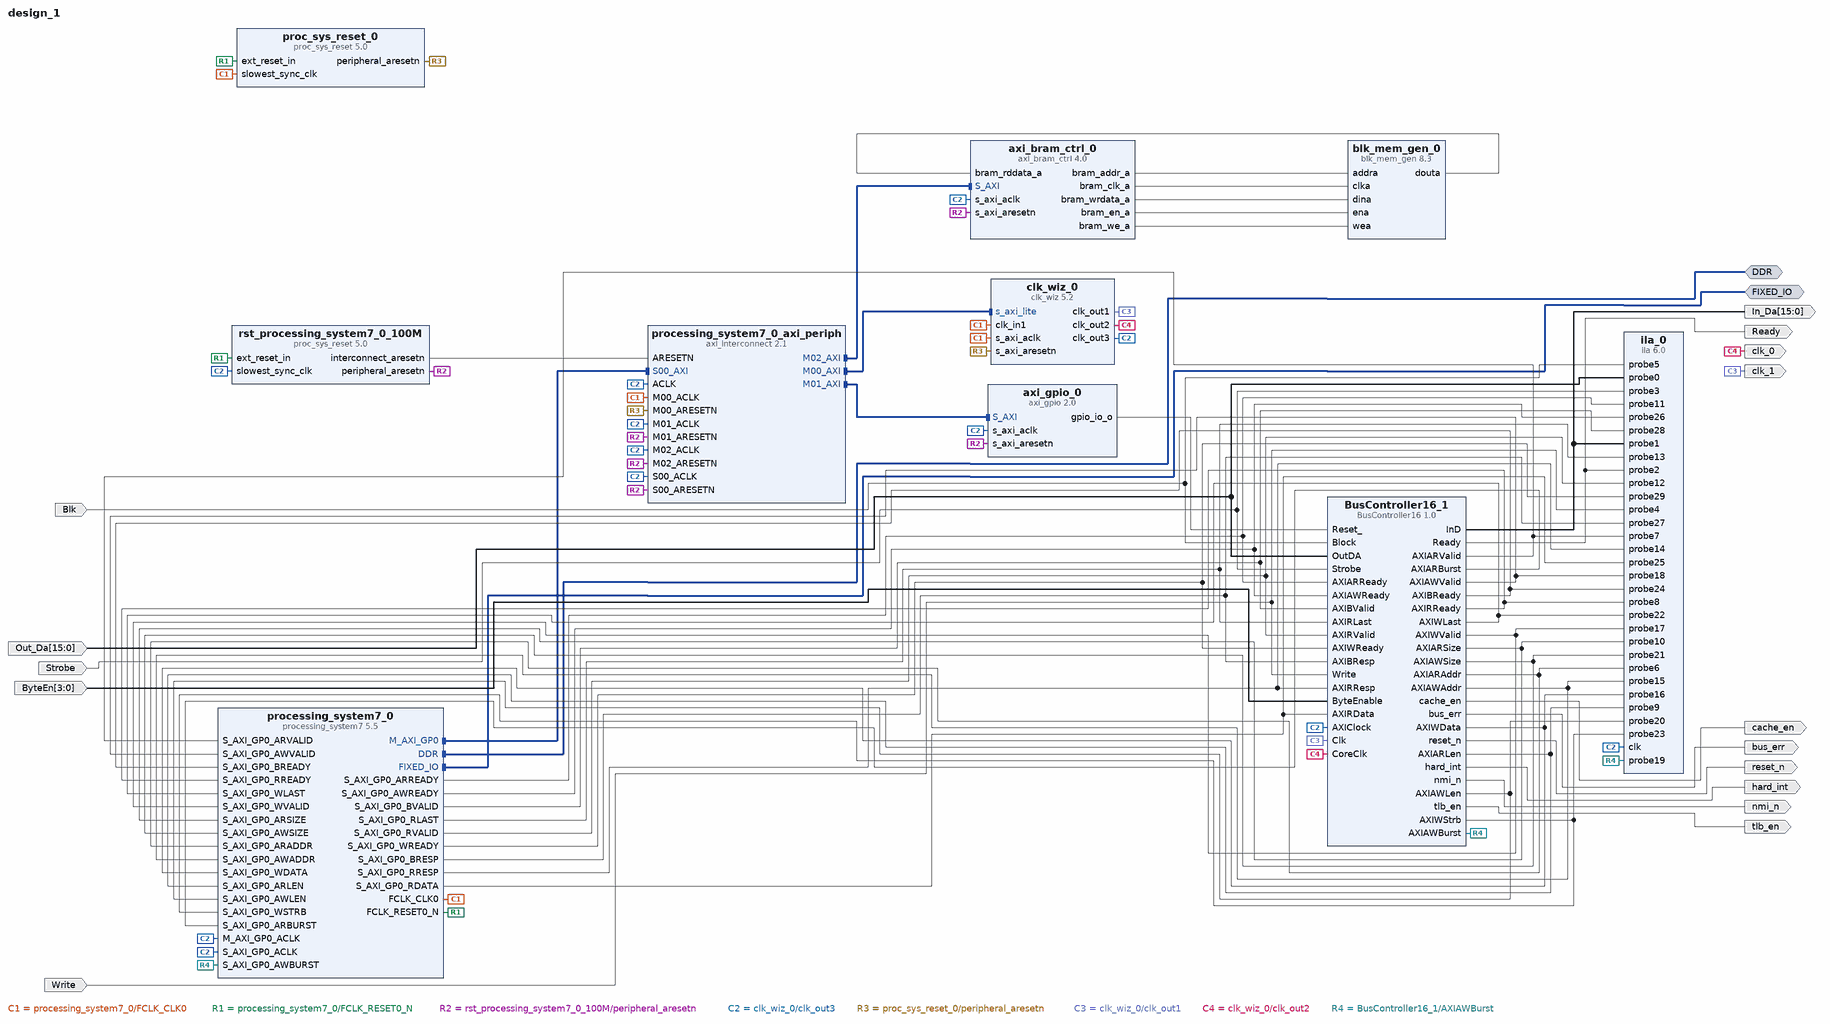
[diagram p0: block diagram of the top level]
# Vivado block design design_1, Vivado 2015.4
create_bd_design design_1

create_bd_intf_port -mode Master -vlnv xilinx.com:interface:ddrx_rtl:1.0 DDR
create_bd_intf_port -mode Master -vlnv xilinx.com:display_processing_system7:fixedio_rtl:1.0 FIXED_IO
create_bd_port -dir I Strobe
create_bd_port -dir I Write
create_bd_port -dir I Blk
create_bd_port -dir I -from 15 -to 0 Out_Da
create_bd_port -dir I -from 3 -to 0 ByteEn
create_bd_port -dir O clk_0
create_bd_port -dir O -type clk clk_1
create_bd_port -dir O reset_n
create_bd_port -dir O nmi_n
create_bd_port -dir O tlb_en
create_bd_port -dir O bus_err
create_bd_port -dir O hard_int
create_bd_port -dir O cache_en
create_bd_port -dir O Ready
create_bd_port -dir O -from 15 -to 0 In_Da

create_bd_cell -type ip -vlnv xilinx.com:ip:processing_system7:5.5 processing_system7_0
set_property -dict [list \
  CONFIG.PCW_FCLK_CLK0_BUF true \
  CONFIG.PCW_APU_PERIPHERAL_FREQMHZ 667 \
  CONFIG.PCW_QSPI_PERIPHERAL_FREQMHZ 200.000000 \
  CONFIG.PCW_SDIO_PERIPHERAL_FREQMHZ 50 \
  CONFIG.PCW_UART_PERIPHERAL_FREQMHZ 50 \
  CONFIG.PCW_FPGA0_PERIPHERAL_FREQMHZ 100 \
  CONFIG.PCW_FPGA1_PERIPHERAL_FREQMHZ 100 \
  CONFIG.PCW_FPGA2_PERIPHERAL_FREQMHZ 33.333333 \
  CONFIG.PCW_USE_S_AXI_GP0 1 \
  CONFIG.PCW_PRESET_BANK1_VOLTAGE {LVCMOS 1.8V} \
  CONFIG.PCW_UIPARAM_DDR_PARTNO {MT41K256M16 RE-125} \
  CONFIG.PCW_QSPI_PERIPHERAL_ENABLE 1 \
  CONFIG.PCW_QSPI_GRP_SINGLE_SS_ENABLE 1 \
  CONFIG.PCW_QSPI_GRP_SINGLE_SS_IO {MIO 1 .. 6} \
  CONFIG.PCW_QSPI_GRP_FBCLK_ENABLE 1 \
  CONFIG.PCW_QSPI_GRP_FBCLK_IO {MIO 8} \
  CONFIG.PCW_ENET0_PERIPHERAL_ENABLE 1 \
  CONFIG.PCW_ENET0_ENET0_IO {MIO 16 .. 27} \
  CONFIG.PCW_ENET0_GRP_MDIO_ENABLE 1 \
  CONFIG.PCW_ENET0_GRP_MDIO_IO {MIO 52 .. 53} \
  CONFIG.PCW_ENET0_RESET_ENABLE 0 \
  CONFIG.PCW_SD0_PERIPHERAL_ENABLE 1 \
  CONFIG.PCW_SD0_SD0_IO {MIO 40 .. 45} \
  CONFIG.PCW_SD0_GRP_CD_ENABLE 1 \
  CONFIG.PCW_SD0_GRP_CD_IO {MIO 46} \
  CONFIG.PCW_SD0_GRP_WP_ENABLE 1 \
  CONFIG.PCW_SD0_GRP_WP_IO {MIO 50} \
  CONFIG.PCW_UART1_PERIPHERAL_ENABLE 1 \
  CONFIG.PCW_UART1_UART1_IO {MIO 48 .. 49} \
  CONFIG.PCW_TTC0_PERIPHERAL_ENABLE 1 \
  CONFIG.PCW_TTC0_TTC0_IO EMIO \
  CONFIG.PCW_USB0_PERIPHERAL_ENABLE 1 \
  CONFIG.PCW_USB0_USB0_IO {MIO 28 .. 39} \
  CONFIG.PCW_USB0_RESET_ENABLE 1 \
  CONFIG.PCW_USB0_RESET_IO {MIO 7} \
  CONFIG.PCW_I2C0_PERIPHERAL_ENABLE 1 \
  CONFIG.PCW_I2C0_I2C0_IO {MIO 14 .. 15} \
  CONFIG.PCW_I2C_RESET_ENABLE 0 \
  CONFIG.PCW_GPIO_PERIPHERAL_ENABLE 1 \
  CONFIG.PCW_GPIO_MIO_GPIO_ENABLE 1 \
] [get_bd_cells processing_system7_0]
# 160 more settings of processing_system7_0 are not shown: defaults, MIO pin electricals, DDR timing, and values the tool derives
create_bd_cell -type ip -vlnv xilinx.com:ip:clk_wiz:5.2 clk_wiz_0
set_property -dict [list \
  CONFIG.PRIMITIVE MMCM \
  CONFIG.USE_DYN_RECONFIG true \
  CONFIG.CLKOUT2_USED true \
  CONFIG.CLKOUT3_USED true \
  CONFIG.NUM_OUT_CLKS 3 \
  CONFIG.CLKOUT1_REQUESTED_OUT_FREQ 15.000 \
  CONFIG.CLKOUT2_REQUESTED_OUT_FREQ 30.000 \
  CONFIG.CLKOUT3_REQUESTED_OUT_FREQ 60.000 \
  CONFIG.CLKOUT1_DRIVES BUFG \
  CONFIG.CLKOUT2_DRIVES BUFG \
  CONFIG.CLKOUT3_DRIVES BUFG \
  CONFIG.CLKOUT4_DRIVES BUFG \
  CONFIG.CLKOUT5_DRIVES BUFG \
  CONFIG.CLKOUT6_DRIVES BUFG \
  CONFIG.CLKOUT7_DRIVES BUFG \
  CONFIG.FEEDBACK_SOURCE FDBK_AUTO \
  CONFIG.MMCM_DIVCLK_DIVIDE 5 \
  CONFIG.MMCM_CLKFBOUT_MULT_F 51.000 \
  CONFIG.MMCM_COMPENSATION ZHOLD \
  CONFIG.MMCM_CLKOUT0_DIVIDE_F 68.000 \
  CONFIG.MMCM_CLKOUT1_DIVIDE 34 \
  CONFIG.MMCM_CLKOUT2_DIVIDE 17 \
  CONFIG.CLKOUT1_JITTER 325.072 \
  CONFIG.CLKOUT1_PHASE_ERROR 300.046 \
  CONFIG.CLKOUT2_JITTER 284.425 \
  CONFIG.CLKOUT2_PHASE_ERROR 300.046 \
  CONFIG.CLKOUT3_JITTER 254.384 \
  CONFIG.CLKOUT3_PHASE_ERROR 300.046 \
] [get_bd_cells clk_wiz_0]
create_bd_cell -type ip -vlnv xilinx.com:ip:axi_gpio:2.0 axi_gpio_0
set_property -dict {CONFIG.C_GPIO_WIDTH 1 CONFIG.C_DOUT_DEFAULT 0x00000001 CONFIG.C_ALL_OUTPUTS 1} [get_bd_cells axi_gpio_0]
create_bd_cell -type ip -vlnv xilinx.com:ip:axi_interconnect:2.1 processing_system7_0_axi_periph
set_property -dict {CONFIG.NUM_MI 3} [get_bd_cells processing_system7_0_axi_periph]
create_bd_cell -type ip -vlnv xilinx.com:ip:proc_sys_reset:5.0 rst_processing_system7_0_100M
create_bd_cell -type ip -vlnv xilinx.com:ip:proc_sys_reset:5.0 proc_sys_reset_0
create_bd_cell -type ip -vlnv xilinx.com:ip:ila:6.0 ila_0
set_property -dict [list \
  CONFIG.C_PROBE27_WIDTH 2 \
  CONFIG.C_PROBE25_WIDTH 32 \
  CONFIG.C_PROBE23_WIDTH 4 \
  CONFIG.C_PROBE21_WIDTH 3 \
  CONFIG.C_PROBE20_WIDTH 4 \
  CONFIG.C_PROBE19_WIDTH 2 \
  CONFIG.C_PROBE16_WIDTH 32 \
  CONFIG.C_PROBE15_WIDTH 32 \
  CONFIG.C_PROBE14_WIDTH 2 \
  CONFIG.C_PROBE10_WIDTH 3 \
  CONFIG.C_PROBE9_WIDTH 4 \
  CONFIG.C_PROBE6_WIDTH 32 \
  CONFIG.C_PROBE1_WIDTH 16 \
  CONFIG.C_PROBE0_WIDTH 16 \
  CONFIG.C_DATA_DEPTH 8192 \
  CONFIG.C_NUM_OF_PROBES 30 \
  CONFIG.C_ENABLE_ILA_AXI_MON false \
  CONFIG.C_MONITOR_TYPE Native \
] [get_bd_cells ila_0]
create_bd_cell -type ip -vlnv xilinx.com:ip:blk_mem_gen:8.3 blk_mem_gen_0
set_property -dict [list \
  CONFIG.Enable_32bit_Address false \
  CONFIG.Use_Byte_Write_Enable false \
  CONFIG.Write_Depth_A 8192 \
  CONFIG.Register_PortA_Output_of_Memory_Primitives false \
  CONFIG.Use_RSTA_Pin false \
  CONFIG.use_bram_block Stand_Alone \
] [get_bd_cells blk_mem_gen_0]
create_bd_cell -type ip -vlnv xilinx.com:ip:axi_bram_ctrl:4.0 axi_bram_ctrl_0
set_property -dict {CONFIG.SINGLE_PORT_BRAM 1} [get_bd_cells axi_bram_ctrl_0]
create_bd_cell -type ip -vlnv xilinx.com:user:BusController16:1.0 BusController16_1

# ---- connections ----

connect_bd_intf_net [get_bd_intf_pins processing_system7_0/M_AXI_GP0] [get_bd_intf_pins processing_system7_0_axi_periph/S00_AXI]
connect_bd_intf_net [get_bd_intf_pins processing_system7_0_axi_periph/M00_AXI] [get_bd_intf_pins clk_wiz_0/s_axi_lite]
connect_bd_intf_net [get_bd_intf_pins processing_system7_0_axi_periph/M01_AXI] [get_bd_intf_pins axi_gpio_0/S_AXI]
connect_bd_intf_net [get_bd_intf_pins processing_system7_0_axi_periph/M02_AXI] [get_bd_intf_pins axi_bram_ctrl_0/S_AXI]
connect_bd_intf_net [get_bd_intf_ports DDR] [get_bd_intf_pins processing_system7_0/DDR]
connect_bd_intf_net [get_bd_intf_ports FIXED_IO] [get_bd_intf_pins processing_system7_0/FIXED_IO]
connect_bd_net [get_bd_pins processing_system7_0/FCLK_CLK0] \
  [get_bd_pins clk_wiz_0/s_axi_aclk] [get_bd_pins processing_system7_0_axi_periph/M00_ACLK] [get_bd_pins clk_wiz_0/clk_in1] \
  [get_bd_pins proc_sys_reset_0/slowest_sync_clk]
connect_bd_net [get_bd_pins processing_system7_0/FCLK_RESET0_N] \
  [get_bd_pins rst_processing_system7_0_100M/ext_reset_in] [get_bd_pins proc_sys_reset_0/ext_reset_in]
connect_bd_net [get_bd_pins rst_processing_system7_0_100M/peripheral_aresetn] \
  [get_bd_pins processing_system7_0_axi_periph/S00_ARESETN] [get_bd_pins axi_gpio_0/s_axi_aresetn] \
  [get_bd_pins processing_system7_0_axi_periph/M01_ARESETN] [get_bd_pins axi_bram_ctrl_0/s_axi_aresetn] \
  [get_bd_pins processing_system7_0_axi_periph/M02_ARESETN]
connect_bd_net [get_bd_pins rst_processing_system7_0_100M/interconnect_aresetn] [get_bd_pins processing_system7_0_axi_periph/ARESETN]
connect_bd_net [get_bd_pins clk_wiz_0/clk_out3] \
  [get_bd_pins axi_gpio_0/s_axi_aclk] [get_bd_pins processing_system7_0_axi_periph/M01_ACLK] \
  [get_bd_pins processing_system7_0_axi_periph/S00_ACLK] [get_bd_pins processing_system7_0_axi_periph/ACLK] \
  [get_bd_pins rst_processing_system7_0_100M/slowest_sync_clk] [get_bd_pins processing_system7_0/S_AXI_GP0_ACLK] \
  [get_bd_pins processing_system7_0/M_AXI_GP0_ACLK] [get_bd_pins ila_0/clk] [get_bd_pins axi_bram_ctrl_0/s_axi_aclk] \
  [get_bd_pins processing_system7_0_axi_periph/M02_ACLK] [get_bd_pins BusController16_1/AXIClock]
connect_bd_net [get_bd_pins proc_sys_reset_0/peripheral_aresetn] \
  [get_bd_pins clk_wiz_0/s_axi_aresetn] [get_bd_pins processing_system7_0_axi_periph/M00_ARESETN]
connect_bd_net [get_bd_pins axi_gpio_0/gpio_io_o] [get_bd_pins BusController16_1/Reset_]
connect_bd_net [get_bd_ports Blk] [get_bd_pins ila_0/probe5] [get_bd_pins BusController16_1/Block]
connect_bd_net [get_bd_ports ByteEn] [get_bd_pins BusController16_1/ByteEnable]
connect_bd_net [get_bd_ports Out_Da] [get_bd_pins ila_0/probe0] [get_bd_pins BusController16_1/OutDA]
connect_bd_net [get_bd_ports Strobe] [get_bd_pins ila_0/probe3] [get_bd_pins BusController16_1/Strobe]
connect_bd_net [get_bd_ports Write] [get_bd_pins ila_0/probe4] [get_bd_pins BusController16_1/Write]
connect_bd_net -net BusController16_0_Ready [get_bd_pins BusController16_1/Ready] [get_bd_ports Ready] [get_bd_pins ila_0/probe2]
connect_bd_net -net BusController16_0_InD [get_bd_pins BusController16_1/InD] [get_bd_ports In_Da] [get_bd_pins ila_0/probe1]
connect_bd_net [get_bd_pins clk_wiz_0/clk_out1] [get_bd_ports clk_1] [get_bd_pins BusController16_1/Clk]
connect_bd_net [get_bd_pins clk_wiz_0/clk_out2] [get_bd_ports clk_0] [get_bd_pins BusController16_1/CoreClk]
connect_bd_net [get_bd_pins processing_system7_0/S_AXI_GP0_ARREADY] [get_bd_pins ila_0/probe11] [get_bd_pins BusController16_1/AXIARReady]
connect_bd_net [get_bd_pins processing_system7_0/S_AXI_GP0_AWREADY] [get_bd_pins ila_0/probe26] [get_bd_pins BusController16_1/AXIAWReady]
connect_bd_net [get_bd_pins processing_system7_0/S_AXI_GP0_BVALID] [get_bd_pins ila_0/probe28] [get_bd_pins BusController16_1/AXIBValid]
connect_bd_net [get_bd_pins processing_system7_0/S_AXI_GP0_RLAST] [get_bd_pins ila_0/probe13] [get_bd_pins BusController16_1/AXIRLast]
connect_bd_net [get_bd_pins processing_system7_0/S_AXI_GP0_RVALID] [get_bd_pins ila_0/probe12] [get_bd_pins BusController16_1/AXIRValid]
connect_bd_net [get_bd_pins processing_system7_0/S_AXI_GP0_WREADY] [get_bd_pins ila_0/probe29] [get_bd_pins BusController16_1/AXIWReady]
connect_bd_net [get_bd_pins processing_system7_0/S_AXI_GP0_BRESP] [get_bd_pins ila_0/probe27] [get_bd_pins BusController16_1/AXIBResp]
connect_bd_net [get_bd_pins processing_system7_0/S_AXI_GP0_RRESP] [get_bd_pins ila_0/probe14] [get_bd_pins BusController16_1/AXIRResp]
connect_bd_net [get_bd_pins processing_system7_0/S_AXI_GP0_RDATA] [get_bd_pins ila_0/probe25] [get_bd_pins BusController16_1/AXIRData]
connect_bd_net -net BusController16_0_AXIARValid [get_bd_pins BusController16_1/AXIARValid] \
  [get_bd_pins processing_system7_0/S_AXI_GP0_ARVALID] [get_bd_pins ila_0/probe7]
connect_bd_net -net BusController16_0_AXIAWValid [get_bd_pins BusController16_1/AXIAWValid] \
  [get_bd_pins processing_system7_0/S_AXI_GP0_AWVALID] [get_bd_pins ila_0/probe18]
connect_bd_net -net BusController16_0_AXIBReady [get_bd_pins BusController16_1/AXIBReady] \
  [get_bd_pins processing_system7_0/S_AXI_GP0_BREADY] [get_bd_pins ila_0/probe24]
connect_bd_net -net BusController16_0_AXIRReady [get_bd_pins BusController16_1/AXIRReady] \
  [get_bd_pins processing_system7_0/S_AXI_GP0_RREADY] [get_bd_pins ila_0/probe8]
connect_bd_net -net BusController16_0_AXIWLast [get_bd_pins BusController16_1/AXIWLast] \
  [get_bd_pins processing_system7_0/S_AXI_GP0_WLAST] [get_bd_pins ila_0/probe22]
connect_bd_net -net BusController16_0_AXIWValid [get_bd_pins BusController16_1/AXIWValid] \
  [get_bd_pins processing_system7_0/S_AXI_GP0_WVALID] [get_bd_pins ila_0/probe17]
connect_bd_net -net BusController16_0_AXIARSize [get_bd_pins BusController16_1/AXIARSize] \
  [get_bd_pins processing_system7_0/S_AXI_GP0_ARSIZE] [get_bd_pins ila_0/probe10]
connect_bd_net -net BusController16_0_AXIAWBurst [get_bd_pins BusController16_1/AXIAWBurst] \
  [get_bd_pins processing_system7_0/S_AXI_GP0_AWBURST] [get_bd_pins ila_0/probe19]
connect_bd_net -net BusController16_0_AXIAWSize [get_bd_pins BusController16_1/AXIAWSize] \
  [get_bd_pins processing_system7_0/S_AXI_GP0_AWSIZE] [get_bd_pins ila_0/probe21]
connect_bd_net -net BusController16_0_AXIARAddr [get_bd_pins BusController16_1/AXIARAddr] \
  [get_bd_pins processing_system7_0/S_AXI_GP0_ARADDR] [get_bd_pins ila_0/probe6]
connect_bd_net -net BusController16_0_AXIAWAddr [get_bd_pins BusController16_1/AXIAWAddr] \
  [get_bd_pins processing_system7_0/S_AXI_GP0_AWADDR] [get_bd_pins ila_0/probe15]
connect_bd_net -net BusController16_0_AXIWData [get_bd_pins BusController16_1/AXIWData] \
  [get_bd_pins processing_system7_0/S_AXI_GP0_WDATA] [get_bd_pins ila_0/probe16]
connect_bd_net -net BusController16_0_AXIARLen [get_bd_pins BusController16_1/AXIARLen] \
  [get_bd_pins processing_system7_0/S_AXI_GP0_ARLEN] [get_bd_pins ila_0/probe9]
connect_bd_net -net BusController16_0_AXIAWLen [get_bd_pins BusController16_1/AXIAWLen] \
  [get_bd_pins processing_system7_0/S_AXI_GP0_AWLEN] [get_bd_pins ila_0/probe20]
connect_bd_net -net BusController16_0_AXIWStrb [get_bd_pins BusController16_1/AXIWStrb] \
  [get_bd_pins processing_system7_0/S_AXI_GP0_WSTRB] [get_bd_pins ila_0/probe23]
connect_bd_net [get_bd_pins axi_bram_ctrl_0/bram_addr_a] [get_bd_pins blk_mem_gen_0/addra]
connect_bd_net [get_bd_pins axi_bram_ctrl_0/bram_clk_a] [get_bd_pins blk_mem_gen_0/clka]
connect_bd_net [get_bd_pins axi_bram_ctrl_0/bram_wrdata_a] [get_bd_pins blk_mem_gen_0/dina]
connect_bd_net [get_bd_pins blk_mem_gen_0/douta] [get_bd_pins axi_bram_ctrl_0/bram_rddata_a]
connect_bd_net [get_bd_pins axi_bram_ctrl_0/bram_en_a] [get_bd_pins blk_mem_gen_0/ena]
connect_bd_net [get_bd_pins axi_bram_ctrl_0/bram_we_a] [get_bd_pins blk_mem_gen_0/wea]
connect_bd_net [get_bd_pins BusController16_1/AXIARBurst] [get_bd_pins processing_system7_0/S_AXI_GP0_ARBURST]
connect_bd_net [get_bd_pins BusController16_1/reset_n] [get_bd_ports reset_n]
connect_bd_net [get_bd_pins BusController16_1/cache_en] [get_bd_ports cache_en]
connect_bd_net [get_bd_pins BusController16_1/tlb_en] [get_bd_ports tlb_en]
connect_bd_net [get_bd_pins BusController16_1/bus_err] [get_bd_ports bus_err]
connect_bd_net [get_bd_pins BusController16_1/nmi_n] [get_bd_ports nmi_n]
connect_bd_net [get_bd_pins BusController16_1/hard_int] [get_bd_ports hard_int]

# ---- address map ----
assign_bd_address -offset 0x40000000 -range 8K -target_address_space [get_bd_addr_spaces processing_system7_0/Data] [get_bd_addr_segs axi_bram_ctrl_0/S_AXI/Mem0]
assign_bd_address -offset 0x41200000 -range 64K -target_address_space [get_bd_addr_spaces processing_system7_0/Data] [get_bd_addr_segs axi_gpio_0/S_AXI/Reg]
assign_bd_address -offset 0x43C00000 -range 64K -target_address_space [get_bd_addr_spaces processing_system7_0/Data] [get_bd_addr_segs clk_wiz_0/s_axi_lite/Reg]

validate_bd_design
save_bd_design
